# EAGLE design dual_uart (EAGLE 6.4)
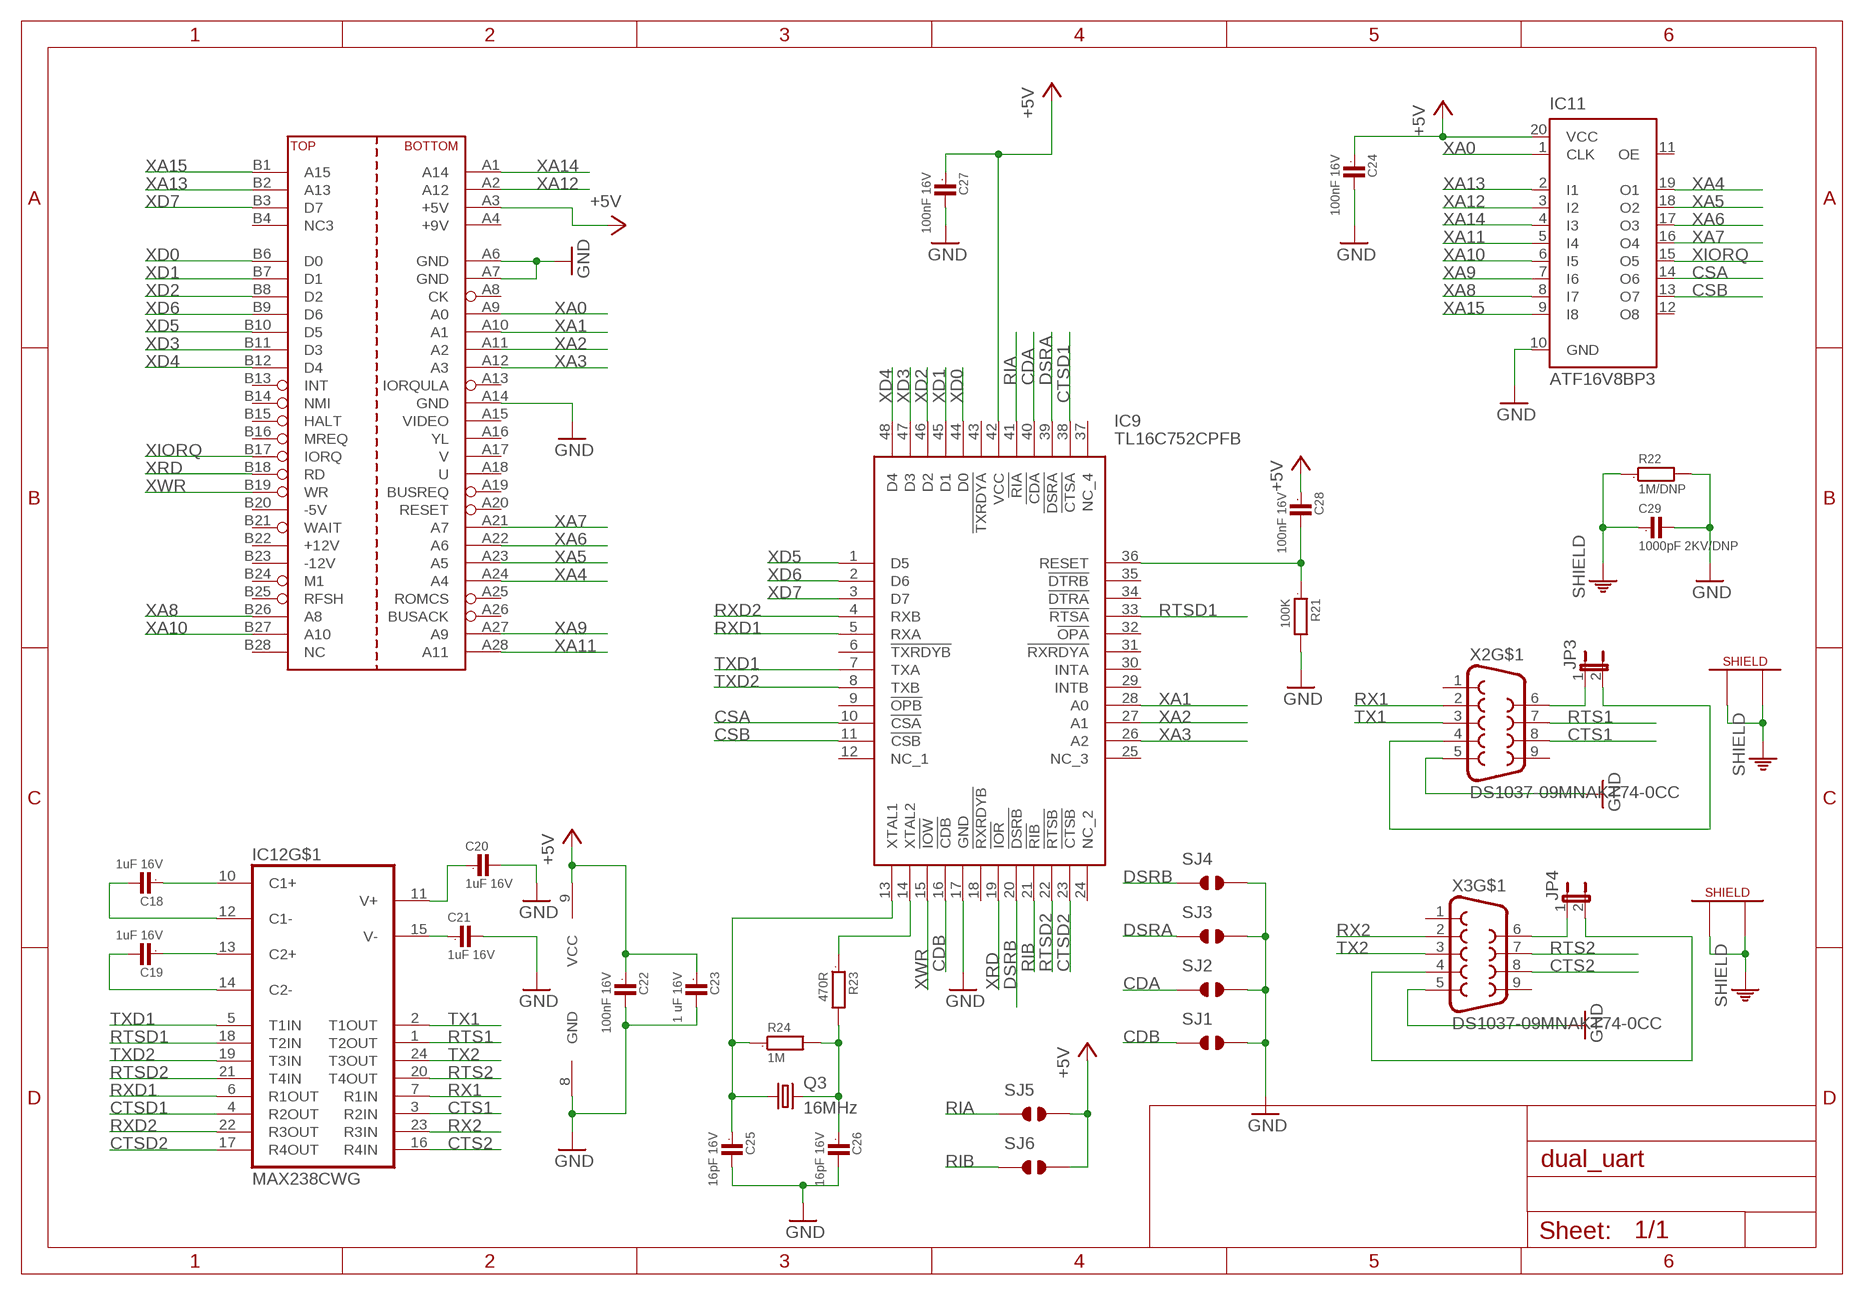
[diagram p0: schematic, sheet 1]

## Parts
C18  1uF 16V  C0603  [0603]
C19  1uF 16V  C0603  [0603]
C20  1uF 16V  C0603  [0603]
C21  1uF 16V  C0603  [0603]
C22  100nF 16V  C0603  [0603]
C23  1 uF 16V  C0603  [0603]
C24  100nF 16V  C0603  [0603]
C25  16pF 16V  C0603  [0603]
C26  16pF 16V  C0603  [0603]
C27  100nF 16V  C0603  [0603]
C28  100nF 16V  C0603  [0603]
C29  1000pF 2KV/DNP  C1210  [1210]
CONN2  ZX_EDGE_DAUGHTERBOARD  [ZX-EDGE-DAUGHTERBOARD@1]
IC9  TL16C752CPFB  [QFP50P900X900X120-48N]
IC11  ATF16V8BP3  [DIL20]
IC12  MAX238CWG  [SO24L]
JP3  JP1E  [JP1]
JP4  JP1E  [JP1]
Q3  16MHz  CRYSTALHC49S  [HC49/S]
R21  100K  R0603  [0603]
R22  1M/DNP  R0805  [0805]
R23  470R  R0603  [0603]
R24  1M  R0603  [0603]
SJ1  JUMPER_SOLDER_1X2  [JUMPER_SOLDER_1X2]
SJ2  JUMPER_SOLDER_1X2  [JUMPER_SOLDER_1X2]
SJ3  JUMPER_SOLDER_1X2  [JUMPER_SOLDER_1X2]
SJ4  JUMPER_SOLDER_1X2  [JUMPER_SOLDER_1X2]
SJ5  JUMPER_SOLDER_1X2  [JUMPER_SOLDER_1X2]
SJ6  JUMPER_SOLDER_1X2  [JUMPER_SOLDER_1X2]
X2  DS1037-09MNAKT74-0CC  DB9MALE  [DB9_MALE]
X3  DS1037-09MNAKT74-0CC  DB9MALE  [DB9_MALE]

## Nets
+5V: C22.1 C23.1 C24.1 C27.1 C28.1 CONN2.A3(+5V) IC9.42(VCC) IC11.20(VCC) IC12.9(VCC) SJ5.2 SJ6.2
CDA: IC9.40(!CDA) SJ2.1
CDB: IC9.16(!CDB) SJ1.1
CSA: IC9.10(!CSA) IC11.14(O6)
CSB: IC9.11(!CSB) IC11.13(O7)
CTS1: IC12.3(R2IN) X2.8
CTS2: IC12.16(R4IN) X3.8
CTSD1: IC9.38(!CTSA) IC12.4(R2OUT)
CTSD2: IC9.23(!CTSB) IC12.17(R4OUT)
DSRA: IC9.39(!DSRA) SJ3.1
DSRB: IC9.20(!DSRB) SJ4.1
GND: C20.2 C21.2 C22.2 C23.2 C24.2 C25.2 C26.2 C27.2 C29.2 CONN2.A6(GND) CONN2.A7(GND) CONN2.A14(GND) IC9.17(GND) IC11.10(GND) IC12.8(GND) R21.2 R22.2 SJ1.2 SJ2.2 SJ3.2 SJ4.2 X2.5 X3.5
N$20: C21.1 IC12.15(V-)
N$21: C20.1 IC12.11(V+)
N$22: C18.2 IC12.12(C1-)
N$23: C18.1 IC12.10(C1+)
N$24: C19.1 IC12.13(C2+)
N$25: C19.2 IC12.14(C2-)
N$26: JP4.1 X3.6
N$27: JP4.2 X3.4
N$28: JP3.1 X2.6
N$29: JP3.2 X2.4
N$30: C26.1 Q3.2 R23.2 R24.2
N$32: C25.1 IC9.13(XTAL1) Q3.1 R24.1
N$33: IC9.14(XTAL2) R23.1
N$46: C28.2 IC9.36(RESET) R21.1
PE: C29.1 R22.1 X2.G1 X2.G2 X3.G1 X3.G2 ; supply symbol labelled SHIELD
RIA: IC9.41(!RIA) SJ5.1
RIB: IC9.21(!RIB) SJ6.1
RTS1: IC12.1(T2OUT) X2.7
RTS2: IC12.20(T4OUT) X3.7
RTSD1: IC9.33(!RTSA) IC12.18(T2IN)
RTSD2: IC9.22(!RTSB) IC12.21(T4IN)
RX1: IC12.7(R1IN) X2.2
RX2: IC12.23(R3IN) X3.2
RXD1: IC9.5(RXA) IC12.6(R1OUT)
RXD2: IC9.4(RXB) IC12.22(R3OUT)
TX1: IC12.2(T1OUT) X2.3
TX2: IC12.24(T3OUT) X3.3
TXD1: IC9.7(TXA) IC12.5(T1IN)
TXD2: IC9.8(TXB) IC12.19(T3IN)
XA0: CONN2.A9(A0) IC11.1(CLK)
XA1: CONN2.A10(A1) IC9.28(A0)
XA2: CONN2.A11(A2) IC9.27(A1)
XA3: CONN2.A12(A3) IC9.26(A2)
XA4: CONN2.A24(A4) IC11.19(O1)
XA5: CONN2.A23(A5) IC11.18(O2)
XA6: CONN2.A22(A6) IC11.17(O3)
XA7: CONN2.A21(A7) IC11.16(O4)
XA8: CONN2.B26(A8) IC11.8(I7)
XA9: CONN2.A27(A9) IC11.7(I6)
XA10: CONN2.B27(A10) IC11.6(I5)
XA11: CONN2.A28(A11) IC11.5(I4)
XA12: CONN2.A2(A12) IC11.3(I2)
XA13: CONN2.B2(A13) IC11.2(I1)
XA14: CONN2.A1(A14) IC11.4(I3)
XA15: CONN2.B1(A15) IC11.9(I8)
XD0: CONN2.B6(D0) IC9.44(D0)
XD1: CONN2.B7(D1) IC9.45(D1)
XD2: CONN2.B8(D2) IC9.46(D2)
XD3: CONN2.B11(D3) IC9.47(D3)
XD4: CONN2.B12(D4) IC9.48(D4)
XD5: CONN2.B10(D5) IC9.1(D5)
XD6: CONN2.B9(D6) IC9.2(D6)
XD7: CONN2.B3(D7) IC9.3(D7)
XIORQ: CONN2.B17(IORQ) IC11.15(O5)
XRD: CONN2.B18(RD) IC9.19(!IOR)
XWR: CONN2.B19(WR) IC9.15(!IOW)
Unconnected: CONN2.A8(CK) CONN2.A13(IORQULA) CONN2.A15(VIDEO) CONN2.A16(YL) CONN2.A17(V) CONN2.A18(U) CONN2.A19(BUSREQ) CONN2.A20(RESET) CONN2.A25(ROMCS) CONN2.A26(BUSACK) CONN2.B4(NC3) CONN2.B13(INT) CONN2.B14(NMI) CONN2.B15(HALT) CONN2.B16(MREQ) CONN2.B21(WAIT) CONN2.B24(M1) CONN2.B25(RFSH) CONN2.B28(NC) IC9.6(!TXRDYB) IC9.9(!OPB) IC9.12(NC_1) IC9.18(!RXRDYB) IC9.24(NC_2) IC9.25(NC_3) IC9.29(INTB) IC9.30(INTA) IC9.31(!RXRDYA) IC9.32(!OPA) IC9.34(!DTRA) IC9.35(!DTRB) IC9.37(NC_4) IC9.43(!TXRDYA) IC11.11(OE) IC11.12(O8) X2.1 X2.9 X3.1 X3.9

## Power pins joined to a net without a drawn wire
+9V: CONN2.A4(+9V)
+12V: CONN2.B22(+12V)
-5V: CONN2.B20(-5V)
-12V: CONN2.B23(-12V)

## Library data of the parts
C18-C29 = GadgetFactory:C: CAPACITOR, European symbol
CONN2 = zxspectrum:ZX_EDGE_DAUGHTERBOARD
IC9 = SamacSys_Parts:TL16C752CPFB: Dual UART With 64-Byte FIFO Source: Datasheet <http://www.ti.com/lit/gpn/tl16c752c>; DESCRIPTION: Dual UART With 64-Byte FIFO; HEIGHT: 1.2mm; MANUFACTURER_NAME: Texas Instruments; MANUFACTURER_PART_NUMBER: TL16C752CPFB; MOUSER_PART_NUMBER: 595-TL16C752CPFB; MOUSER_PRICE-STOCK: https://www.mouser.com/Search/Refine.aspx?Keyword=595-TL16C752CPFB
IC11 = atmel:ATF16V8B: High perfomance CMOS (electrically erasable) programmable logic device (PLD) ABLE-Atmel-ABEL - P18V8R, P16V8C, P16V8AS, P17V8 COPL Atmel-WinCUPL - G16V8MS, G16V8MA, G16V8AS, G16V8 LOG/IC - GAL16V8_R, GAL16V8_G7, GAL16V8_C), GAL16V8 Tango-PLD - G16V8R, G16V8C, G16V8AS, G16V8 Source: http://www.atmel.com/dyn/resources/prod_documents/DOC0364.PDF; MPN: ATF16V8CZ-15PU; OC_FARNELL: 1551768; OC_NEWARK: 94M6254
IC12 = alvie:MAX238
JP3 JP4 = jumper:JP1E: JUMPER
Q3 = crystal:CRYSTAL: CRYSTAL; OC_FARNELL: 1667008; OC_NEWARK: unknown
R21-R24 = GadgetFactory:R: RESISTOR, European symbol
SJ1-SJ6 = dp_devices:JUMPER_SOLDER_1X2
X2 X3 = SparkFun-Connectors:DB9: DB9 Connector Standard DB9 (D-Sub 9) serial connector. Can be used for CAN bus as well as RS485 and RS232. Footprint production proven. Spark Fun Electronics SKU : PRT-00429

## Board
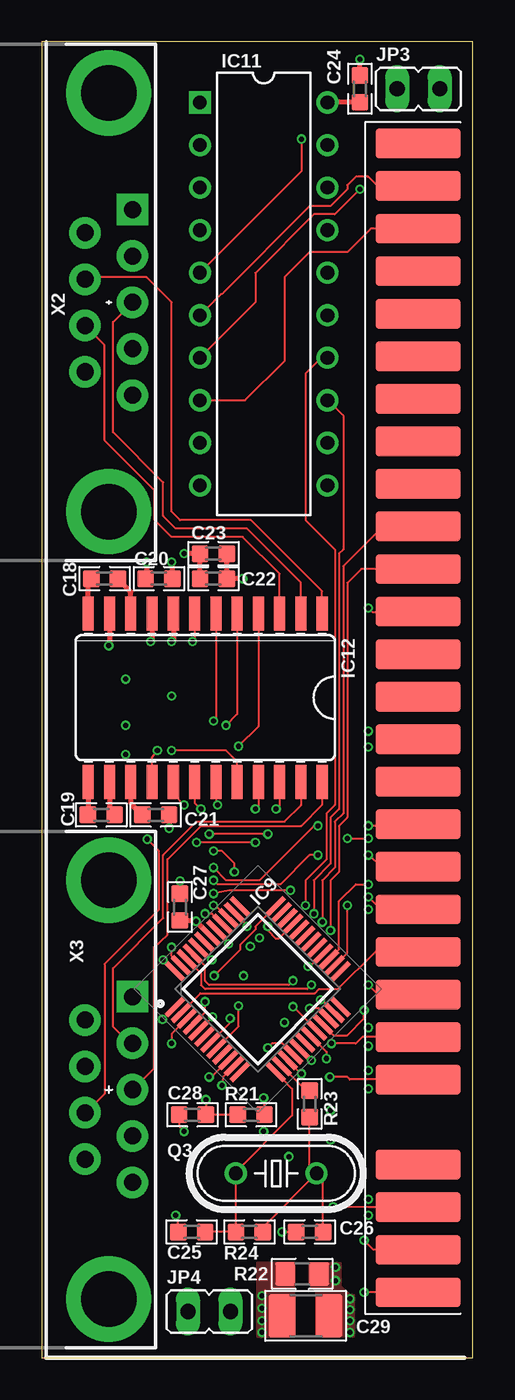
[diagram p1: board, top side]
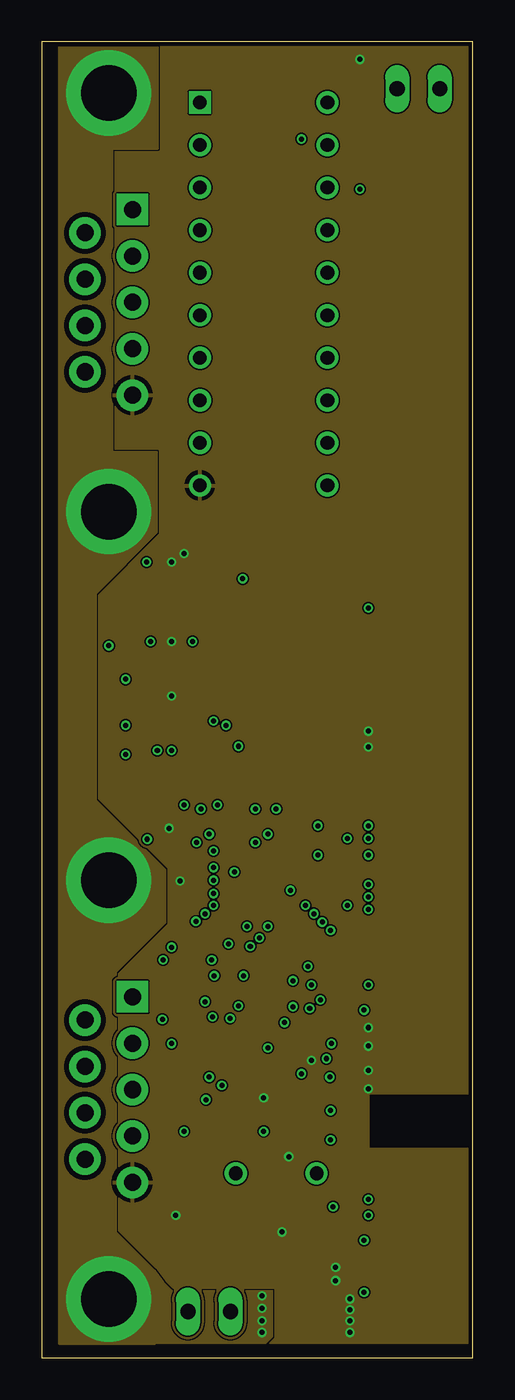
[diagram p2: board, inner layer Route2]
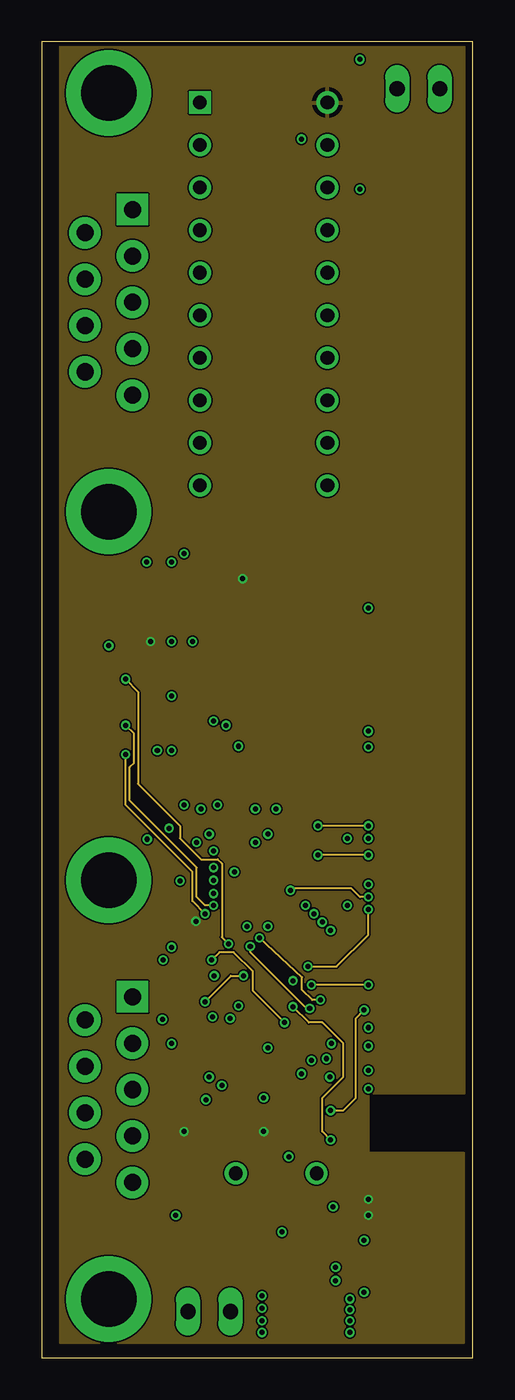
[diagram p3: board, inner layer Route15]
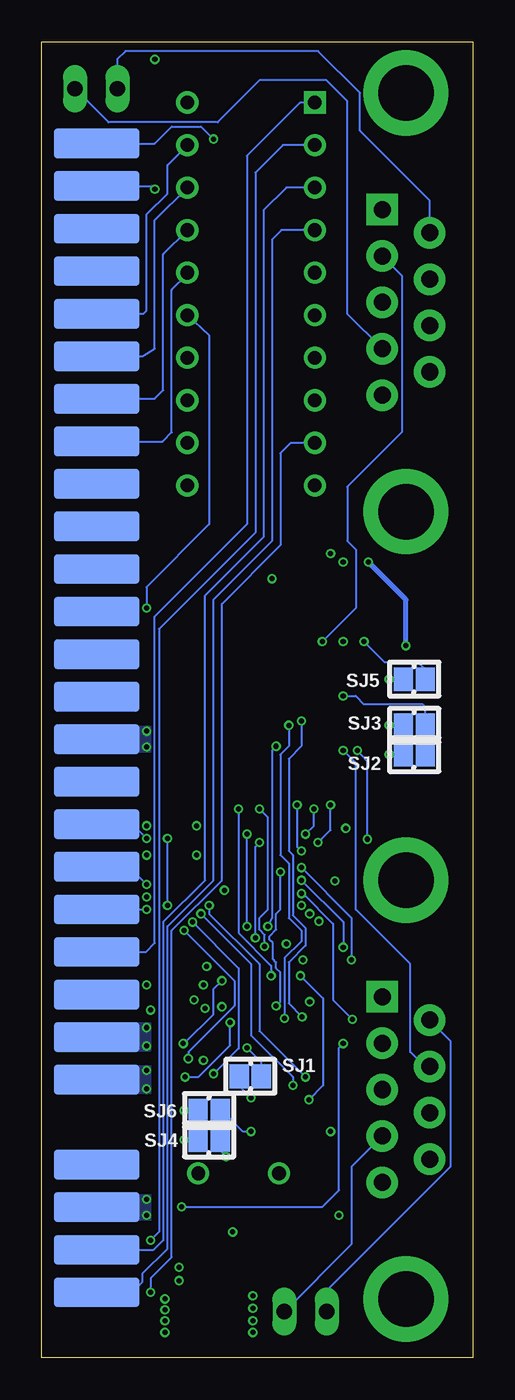
[diagram p4: board, bottom side, seen from below]

Size 25.75 x 78.55 mm. Coordinates in mm from the lower left corner, seen from the top.
Outline: 0,0 25.75,0 25.75,78.55 0,78.55 0,0
Copper layers (1*2*15*16): Top 0.035mm / dielectric 0.18mm / Route2 0.017mm / dielectric 1.12mm / Route15 0.017mm / dielectric 0.18mm / Bottom 0.035mm
Design rules "JLCPCB-FourLayerLayer": minimum track width 3.5mil, minimum drill 0.2mm, track to track 3.5mil, track to pad 5mil, pad to pad 5mil, via to via 5mil, smd to smd 0mil, copper to edge 10mil, drill to drill 10mil, minimum pad ring 10mil, minimum via ring 0.125mm, stop-mask expansion 2mil, vias tented up to drill 100mil, thermal gap 10mil

### Footprints (pad centres in the part's own frame; a part is rotated, then mirrored left to right if it is on the bottom)
0603 = smd 1 x 1: 1 -0.8,0; 2 0.8,0
1210 = smd 1.6 x 2.6: 1 -1.4,0; 2 1.4,0
ZX-EDGE-DAUGHTERBOARD@1 = smd 1.778 x 5.08 bottom: A1 6.35,-1.27; A2 3.81,-1.27; A3 1.27,-1.27; A4 -1.27,-1.27; A6 -6.35,-1.27; A7 -8.89,-1.27; A8 -11.43,-1.27; A9 -13.97,-1.27; A10 -16.51,-1.27; A11 -19.05,-1.27; A12 -21.59,-1.27; A13 -24.13,-1.27; A14 -26.67,-1.27; A15 -29.21,-1.27; A16 -31.75,-1.27; A17 -34.29,-1.27; A18 -36.83,-1.27; A19 -39.37,-1.27; A20 -41.91,-1.27; A21 -44.45,-1.27; A22 -46.99,-1.27; A23 -49.53,-1.27; A24 -52.07,-1.27; A25 -54.61,-1.27; A26 -57.15,-1.27; A27 -59.69,-1.27; A28 -62.23,-1.27 | smd 1.778 x 5.08: B1 6.35,-1.27; B2 3.81,-1.27; B3 1.27,-1.27; B4 -1.27,-1.27; B6 -6.35,-1.27; B7 -8.89,-1.27; B8 -11.43,-1.27; B9 -13.97,-1.27; B10 -16.51,-1.27; B11 -19.05,-1.27; B12 -21.59,-1.27; B13 -24.13,-1.27; B14 -26.67,-1.27; B15 -29.21,-1.27; B16 -31.75,-1.27; B17 -34.29,-1.27; B18 -36.83,-1.27; B19 -39.37,-1.27; B20 -41.91,-1.27; B21 -44.45,-1.27; B22 -46.99,-1.27; B23 -49.53,-1.27; B24 -52.07,-1.27; B25 -54.61,-1.27; B26 -57.15,-1.27; B27 -59.69,-1.27; B28 -62.23,-1.27
QFP50P900X900X120-48N = smd 1.475 x 0.3: 1 -4.238,2.75; 2 -4.238,2.25; 3 -4.238,1.75; 4 -4.238,1.25; 5 -4.238,0.75; 6 -4.238,0.25; 7 -4.238,-0.25; 8 -4.238,-0.75; 9 -4.238,-1.25; 10 -4.238,-1.75; 11 -4.238,-2.25; 12 -4.238,-2.75; 25 4.238,-2.75; 26 4.238,-2.25; 27 4.238,-1.75; 28 4.238,-1.25; 29 4.238,-0.75; 30 4.238,-0.25; 31 4.238,0.25; 32 4.238,0.75; 33 4.238,1.25; 34 4.238,1.75; 35 4.238,2.25; 36 4.238,2.75 | smd 0.3 x 1.475: 13 -2.75,-4.238; 14 -2.25,-4.238; 15 -1.75,-4.238; 16 -1.25,-4.238; 17 -0.75,-4.238; 18 -0.25,-4.238; 19 0.25,-4.238; 20 0.75,-4.238; 21 1.25,-4.238; 22 1.75,-4.238; 23 2.25,-4.238; 24 2.75,-4.238; 37 2.75,4.238; 38 2.25,4.238; 39 1.75,4.238; 40 1.25,4.238; 41 0.75,4.238; 42 0.25,4.238; 43 -0.25,4.238; 44 -0.75,4.238; 45 -1.25,4.238; 46 -1.75,4.238; 47 -2.25,4.238; 48 -2.75,4.238
DIL20 = drill 0.813 square: 1 -11.43,-3.81 | drill 0.813: 2 -8.89,-3.81; 3 -6.35,-3.81; 4 -3.81,-3.81; 5 -1.27,-3.81; 6 1.27,-3.81; 7 3.81,-3.81; 8 6.35,-3.81; 9 8.89,-3.81; 10 11.43,-3.81; 11 11.43,3.81; 12 8.89,3.81; 13 6.35,3.81; 14 3.81,3.81; 15 1.27,3.81; 16 -1.27,3.81; 17 -3.81,3.81; 18 -6.35,3.81; 19 -8.89,3.81; 20 -11.43,3.81
SO24L = smd 0.66 x 2.032: 1 -6.495,-5.679; 2 -5.225,-5.679; 3 -3.955,-5.679; 4 -2.685,-5.679; 5 -1.415,-5.679; 6 -0.145,-5.679; 7 1.125,-5.679; 8 2.395,-5.679; 9 3.665,-5.679; 10 4.935,-5.679; 11 6.205,-5.679; 12 7.475,-5.679; 13 7.475,4.379; 14 6.205,4.379; 15 4.935,4.379; 16 3.665,4.379; 17 2.395,4.379; 18 1.125,4.379; 19 -0.145,4.379; 20 -1.415,4.379; 21 -2.685,4.379; 22 -3.955,4.379; 23 -5.225,4.379; 24 -6.495,4.379
JP1 = drill 0.914 long: 1 0,-1.27; 2 0,1.27
HC49/S = drill 0.813: 1 -2.413,0; 2 2.413,0
0805 = smd 1.2 x 1.4: 1 -1,0; 2 1,0
JUMPER_SOLDER_1X2 = smd 1.143 x 1.422: 1 -0.66,0; 2 0.66,0
DB9_MALE = drill 1.016 pad 1.88 square: 1 5.54,-1.42 | drill 1.016 pad 1.88: 2 2.77,-1.42; 3 0,-1.42; 4 -2.77,-1.42; 5 -5.54,-1.42; 6 4.15,1.42; 7 1.38,1.42; 8 -1.38,1.42; 9 -4.15,1.42 | drill 3.302 pad 5.08: G1 -12.5,0; G2 12.5,0

### Placement (x,y rotation side)
C18  3.75,46.5 180 top
C19  3.55,32.4 0 top
C20  7,46.5 0 top
C21  6.8,32.4 0 top
C22  10.25,46.5 180 top
C23  10.25,48 180 top
C24  19,75.75 90 top
C25  8.95,7.5 180 top
C26  16,7.5 180 top
C27  8.25,26.9 90 top
C28  9,14.5 0 top
C29  15.75,2.5 0 top
CONN2  23.75,10.25 270 top
IC9  12.9,22 45 top
IC11  13.25,63.5 270 top
IC12  10.25,38.75 180 top
JP3  22.5,75.75 270 top
JP4  10,2.75 270 top
Q3  14,11 0 top
R21  12.5,14.5 0 top
R22  15.55,5 0 top
R23  16,15.15 270 top
R24  12.4,7.5 0 top
SJ1  13.3,16.8 180 bottom
SJ2  3.5,36 0 bottom
SJ3  3.5,37.75 0 bottom
SJ4  15.75,13 0 bottom
SJ5  3.5,40.5 0 bottom
SJ6  15.75,14.75 0 bottom
X2  4,63 90 top
X3  4,16 90 top

### Tracks (layer width: path | path; a pad name or v marks a point on that pad's centre or on a via)
+5V  (via drill 0.3)
  Top 0.128: C28.1 8.2,13.8 v8.5,13.5
  Top 0.305: IC12.9 6.58,42.84 v6.5,42.75 | v12,46.5 C22.1 C23.1 | C24.1 17.08,74.95 IC11.20 | IC9.42 v9.2,26.05 9.25,26.1 C27.1
  Bottom 0.128: SJ5.2 2.84,41.09 3.25,41.5 5.25,41.5 v6.5,42.75 | SJ6.2 15,14.75 13.75,13.5 v13.25,13.5
  other vias: 19.5,9.45 19.5,8.5
  pour Route15: 1.1,78.5 25.25,78.5 25.25,15.75 19.5,15.75 19.5,12.25 25.2,12.25 25.2,0.85 1.1,0.85
  pour Bottom (no thermals): 19.25,9.7 20.3,9.7 20.3,8.25 19.25,8.25
CDA  (via drill 0.3)
  Top 0.128: IC9.40 10.17,26.5 v9.75,26.5
  Route15 0.128: v9.75,26.5 9,27.25 9,29 5,33 v5,36
  Bottom 0.128: v5,36 SJ2.1
CDB  (via drill 0.3)
  Top 0.128: IC9.16 14.38,18.75 13.75,18.75 v13.5,18.5
  Bottom 0.128: SJ1.1 12.64,17.64 v13.5,18.5
CSA  (via drill 0.3)
  Top 0.128: IC11.14 16.69,59.69 15.75,58.75 15.75,50 17.5,48.25 17.5,33 17,32.5 17,29.75 15.75,28.5 v15.75,27 | IC9.10 10.12,16.75 v10,16.75
  Bottom 0.128: v15.75,27 15.75,26.5 12.75,23.5 12.75,19.5 v10,16.75
CSB  (via drill 0.3)
  Top 0.128: IC11.13 17.1,57.15 18,56.25 18,48.25 17.75,48 17.75,32.75 17.25,32.25 17.25,29.5 16.25,28.5 v16.25,26.5 | IC9.11 10.83,16.75 v10.75,16.25
  Bottom 0.128: v16.25,26.5 13.25,23.5 13.25,19.25 10.75,16.75 v10.75,16.25
CTS1
  Top 0.128: IC12.3 14.21,46.8 12,49 7.75,49 6.75,50 6.75,51.75 3.75,54.75 3.75,60.45 X2.8
CTS2  (via drill 0.3)
  Top 0.128: v6.3,30.95 7,30.25 7,26.75 3.75,23.5 3.75,15.75 2.62,14.62 X3.8 | IC12.16 6.58,35.81 v6.9,36.25
  Bottom 0.128: v6.3,30.95 6.3,35.6 v6.9,36.25
CTSD1  (via drill 0.3)
  Top 0.128: IC12.4 12.94,37.69 v11.75,36.5 | IC9.38 12.25,25.83 v12.25,25.75
  Bottom 0.128: v11.75,36.5 12,36.25 12,26.25 v12.25,25.75
CTSD2  (via drill 0.3)
  Top 0.128: IC9.23 16.73,21.35 v16.65,21.35 | v12.75,30.75 v9.25,30.75 | IC12.17 7.86,33.65 v8.5,33
  Route15 0.128: v16.65,21.35 16.15,21.35 15.55,21.95 15.55,22.7 v13,25.05
  Bottom 0.128: v13,25.05 13,30.5 v12.75,30.75 | v9.25,30.75 8.5,31.5 v8.5,33
DSRA  (via drill 0.3)
  Top 0.128: IC9.39 10.38,27 v10.25,27
  Route15 0.128: v10.25,27 9.75,27 9.25,27.5 9.25,29.25 5.25,33.25 5.25,35.25 5.5,35.5 5.5,37.25 v5,37.75
  Bottom 0.128: v5,37.75 SJ3.1
DSRB  (via drill 0.3)
  Top 0.128: IC9.20 15.21,20.75 v15,20.95
  Route15 0.128: v17.25,13 16.75,13.5 16.75,15.5 18,16.75 18,18.75 16.75,20 15.95,20 v15,20.95
  Bottom 0.128: SJ4.1 v17.25,13
GND  (via drill 0.3)
  Top 0.128: v14.35,7.5 C26.2 | R21.2 13.3,15.45 v13.25,15.5 | C25.2 8.15,8.35 v8,8.5
  Top 0.305: C21.2 v7.6,31.6 | C20.2 7.8,47.45 v7.75,47.5 | C22.2 C23.2 v8.5,48 | C24.2 v19,77.5 | C27.2 v8.25,28.45 | IC9.17 16.09,17.75 v16.1,17.75 | IC12.8 7.86,42.85 v7.75,42.75
  Bottom 0.128: SJ1.2 13.96,16.21 v13.25,15.5 | SJ2.2 SJ3.2 2.84,38.84 3,39 6.5,39 7,39.5 v7.75,39.5 | SJ4.2 15.09,12.34 v14.75,12
  other vias: 19.5,37.4 19.5,36.45 19.5,19.7 19.5,18.6 19.5,17.15 19.5,16.05 17.55,5.4 17.55,4.6 18.4,3.5 18.4,2.85 18.4,2.2 18.4,1.5
  pour Route2 (rank 3): 1.1,78.5 25.5,78.5 25.5,15.75 19.5,15.75 19.5,12.5 25.5,12.5 25.5,0.85 1.1,0.85
  pour Bottom (no thermals): 19.25,37.65 20.3,37.65 20.3,36.2 19.25,36.2
  pour Bottom (no thermals): 19.25,19.95 20.3,19.95 20.3,18.35 19.25,18.35
  pour Bottom (no thermals): 19.25,17.4 20.3,17.4 20.3,15.8 19.25,15.8
  pour Top (no thermals): 16,5.65 17.85,5.65 17.85,4.3 18.4,3.75 18.65,3.75 18.65,1.25 16.4,1.25 16.4,3.95 16,4.35
N$20
  Top 0.305: IC12.15 5.32,33.09 C21.1
N$21  (via drill 0.3)
  Top 0.305: IC12.11 4.04,42.55 v4,42.5 | v6.25,47.5 6.25,46.55 C20.1
  Bottom 0.305: v4,42.5 4,45.25 v6.25,47.5
N$22
  Top 0.305: IC12.12 2.77,46.33 C18.2
N$23
  Top 0.305: IC12.10 5.32,45.73 C18.1
N$24
  Top 0.128: 2.77,32.42 C19.1
  Top 0.305: IC12.13 2.77,32.42
N$25
  Top 0.128: 4.04,32.7 C19.2
  Top 0.305: IC12.14 4.04,32.7
N$26
  Bottom 0.128: JP4.1 8.75,2.77 8.75,4 1.35,11.4 1.35,18.92 X3.6
N$27
  Bottom 0.128: JP4.2 7.25,6.77 7.25,11.4 X3.4
N$28
  Bottom 0.128: JP3.1 21.25,75.77 21.25,77.5 20.75,78 9.25,78 6.75,75.5 6.75,73.25 2.58,69.08 X2.6
N$29
  Bottom 0.128: JP3.2 21.77,73.75 15.25,73.75 12.75,76.25 8.75,76.25 7.5,75 7.5,62.31 X2.4
N$30
  Top 0.128: C26.1 16.8,10.61 Q3.2 | Q3.2 16,11.41 R23.2 | R24.2 13.2,7.79 Q3.2
N$32
  Top 0.128: IC9.13 14.3,16.7 14.95,16.05 14.95,14.45 11.59,11.09 Q3.1 11.6,10.99 R24.1 C25.1
N$33
  Top 0.128: 14.66,17.04 IC9.14 15.77,15.95 R23.1
N$46  (via drill 0.3)
  Top 0.128: IC9.36 12.75,25.74 12.75,25.55 11.85,24.65 11.85,24.35 v10.3,22.8 | v9.8,15.4 C28.2 R21.1
  Bottom 0.128: v10.3,22.8 8.95,21.45 8.95,16.25 v9.8,15.4
PE  (via drill 0.3)
  other vias: 13.15,3.7 13.15,2.95 13.15,2.2 13.15,1.5
  pour Route2 (isolate 0.305, no thermals): 1.05,78.25 6.9,78.25 6.9,72.15 4.2,72.15 4.2,54.1 6.85,54.1 6.85,49.25 3.2,45.6 3.2,33.3 7.35,29.15 7.35,25.95 4.4,23 4.4,7.5 6.7,5.2 7.25,4.5 7.75,4 13.75,4 13.75,1.25 13.35,0.85 6.7,0.85 6.75,0.8 1.05,0.8
  pour Top (no thermals): 15.1,5.65 12.85,5.65 12.85,1.25 15.1,1.25
RIA  (via drill 0.3)
  Top 0.128: IC9.41 11.15,24.81 v11.15,24.7
  Route15 0.128: v5,40.5 5.75,39.75 5.75,34.25 8.25,31.75 8.25,31 9.5,29.75 10.5,29.75 10.75,29.5 10.75,25.1 v11.15,24.7
  Bottom 0.128: SJ5.1 v5,40.5
RIB  (via drill 0.3)
  Top 0.128: IC9.21 17.42,19.25 18.25,19.25 19.25,20.25 v19.25,20.75
  Route15 0.128: v17.25,14.75 18,14.75 18.75,15.5 18.75,20.25 v19.25,20.75
  Bottom 0.128: SJ6.1 v17.25,14.75
RTS1
  Top 0.128: IC12.1 16.75,45.76 12.5,50 8.25,50 7.75,50.5 7.75,63 6.25,64.5 2.7,64.5 X2.7
RTS2  (via drill 0.3)
  Top 0.128: IC12.20 11.66,35.59 11,36.25 v7.75,36.25
  Bottom 0.128: v7.75,36.25 7,35.5 7,26.75 3.75,23.5 3.75,18.25 2.88,17.38 X3.7
RTSD1  (via drill 0.3)
  Top 0.128: IC9.33 14.13,25 14,25 13.5,25.5 v13.5,25.75 | v13.5,31.25 v10,31.25 | v9.5,32.75 9.12,33.12 IC12.18
  Bottom 0.128: v13.5,25.75 v13.5,31.25 | v10,31.25 9.5,31.75 v9.5,32.75
RTSD2  (via drill 0.3)
  Top 0.128: IC9.22 16.52,20.85 v16,20.85 | 12.8,32.8 v12.75,32.75 12.94,32.94 IC12.21
  Route15 0.128: v16,20.85 15.8,20.85 12.45,24.2 v12.45,24.55
  Bottom 0.128: v12.45,24.55 12.45,25.25 12.75,25.55 12.75,26.25 12.25,26.75 12.25,32.25 v12.75,32.75
RX1  (via drill 0.3)
  Top 0.128: 9.1,42.85 v9,42.75 9.12,42.88 IC12.7
  Bottom 0.128: v9,42.75 7,44.75 7,48.25 7.5,48.75 7.5,52 4.25,55.25 4.25,64.6 X2.2
RX2
  Top 0.128: IC12.23 15.47,32.98 14.5,32 9.25,32 7.25,30 7.25,26.25 4.25,23.25 4.25,19.75 5.23,18.77 X3.2
RXD1  (via drill 0.3)
  Top 0.128: IC12.6 10.39,38.15 v10.25,38 | IC9.5 v10.19,20.35 v10.2,20.35
  Bottom 0.128: v10.25,38 10.25,36.5 11,35.75 11,30.25 10.75,30 10.75,26.4 10,25.65 10,24.6 11,23.6 11,21.15 v10.2,20.35
RXD2  (via drill 0.3)
  Top 0.128: IC12.22 14.21,32.95 v14,32.75 | IC9.4 9.75,20.62 v9.75,21.25
  Route15 0.128: v9.75,21.25 11.3,22.8 v12.05,22.8
  Bottom 0.128: v14,32.75 14,25.35 12.05,23.4 v12.05,22.8
TX1
  Top 0.128: IC12.2 15.47,46.27 12.25,49.5 8,49.5 7.25,50.25 7.25,52.25 4.25,55.25 4.25,61.83 X2.3
TX2
  Top 0.128: IC12.24 16.75,32.99 15.5,31.75 9.5,31.75 7.5,29.75 7.5,25.25 6.7,24.5 6.7,17.28 X3.3
TXD1  (via drill 0.3)
  Top 0.128: IC12.5 11.66,38.41 v11,37.75 | IC9.7 11.25,20 v11.25,20.25
  Bottom 0.128: v11,37.75 11,36.5 11.5,36 11.5,30 11,29.5 11,26.25 10.25,25.5 10.25,24.85 11.25,23.85 v11.25,20.25
TXD2  (via drill 0.3)
  Top 0.128: IC12.19 10.39,33.1 v10.5,33 | IC9.8 11.75,19.79 v11.75,21 | v11.5,29 11.5,29.5 10.75,30.25 v10.25,30.25
  Bottom 0.128: v10.5,33 10.5,30.5 v10.25,30.25 | v11.75,21 11.5,21.25 11.5,23 11.75,23.25 11.75,23.6 11.95,23.8 11.95,24.75 12.15,24.95 12.15,25.15 11.75,25.55 11.75,26.5 11.5,26.75 v11.5,29
XA0
  Bottom 0.128: CONN2.A9 19.53,24.22 19,24.75 19,44.25 13.5,49.75 13.5,71.75 10.32,74.93 IC11.1
XA1  (via drill 0.3)
  Top 0.128: IC9.28 16.02,23.35 v15.9,23.35
  Route15 0.128: v15.9,23.35 17.6,23.35 19.5,25.25 v19.5,26.75
  Bottom 0.128: CONN2.A10 v19.51,26.76 v19.5,26.75
XA2  (via drill 0.3)
  Top 0.128: IC9.27 17.75,24.38 17.75,27.25 18.75,28.25 v19.5,28.25
  Bottom 0.128: CONN2.A11 20.55,29.3 v19.5,28.25
XA3  (via drill 0.3)
  Top 0.128: IC9.26 18.25,24.17 v18.25,27 | v18.25,31 v19.5,31
  Bottom 0.128: CONN2.A12 20.34,31.84 v19.5,31 | v18.25,27 v18.25,31
XA4
  Bottom 0.128: CONN2.A24 19.68,62.32 19.5,62.5 19.5,68.25 18.25,69.5 18.25,71.2 IC11.19
XA5
  Bottom 0.128: CONN2.A23 19.72,59.78 19,60.25 19,67.91 IC11.18
XA6
  Bottom 0.128: CONN2.A22 19.01,57.24 18.5,57.75 18.5,65.87 IC11.17
XA7
  Bottom 0.128: CONN2.A21 18.55,54.7 18,55.25 18,63.75 17.06,64.69 IC11.16
XA8
  Top 0.128: CONN2.B26 19.65,67.4 18.25,66 16,66 14.5,64.5 14.5,59.5 12.15,57.15 IC11.8
XA9  (via drill 0.3)
  Top 0.128: v19,69.75 17.5,68.25 16.25,68.25 12.75,64.75 12.75,63 IC11.7
  Bottom 0.128: CONN2.A27 19.19,69.94 v19,69.75
XA10
  Top 0.128: CONN2.B27 20.06,69.94 19.5,70.5 18.75,70.5 18.25,70 18.25,69.75 17.25,68.75 16,68.75 10.75,63.5 10.71,63.5 IC11.6
XA11  (via drill 0.3)
  Top 0.128: v15.5,72.75 15.5,70.83 IC11.5
  Bottom 0.128: CONN2.A28 19.02,72.48 18,73.5 16.25,73.5 v15.5,72.75
XA12
  Bottom 0.128: CONN2.A2 19.06,6.44 18.5,7 18.5,26 16,28.5 16,45.5 12.5,49 12.5,68.5 11.15,69.85 IC11.3
XA13  (via drill 0.3)
  Top 0.128: CONN2.B2 19.81,6.44 v19.25,7
  Bottom 0.128: IC11.2 11.36,72.39 13,70.75 13,49.25 18.75,43.5 18.75,7.5 v19.25,7
XA14
  Bottom 0.128: CONN2.A1 20.35,3.9 19.75,4.5 19.75,5 18.25,6.5 18.25,25.75 15.5,28.5 15.5,45.25 12,48.75 12,66.75 11.44,67.31 IC11.4
XA15  (via drill 0.3)
  Top 0.128: CONN2.B1 v19.25,3.9
  Bottom 0.128: IC11.9 10.89,54.61 11.5,54 11.5,48.5 15,45 15,28.5 18,25.5 18,6 19.25,4.75 v19.25,3.9
XD0  (via drill 0.3)
  Top 0.128: CONN2.B6 18.4,16.6 18.25,16.75 v17.2,16.75 | v10.15,23.75 10.1,23.74 IC9.44
  Route15 0.128: v10.15,23.75 10.6,24.2 11.45,24.2 12.6,23.05 12.6,21.9 v14.5,20
  Bottom 0.128: v17.2,16.75 16.4,16.75 14.5,18.65 v14.5,20
XD1  (via drill 0.3)
  Top 0.128: CONN2.B7 19.14,19.14 18.75,18.75 v17.3,18.75 | v15,22.5 14.75,22.25 10,22.25 9.75,22.5 9.75,23.38 IC9.45
  Bottom 0.128: v17.3,18.75 17.25,18.75 15.5,20.5 15.5,22 v15,22.5
XD2  (via drill 0.3)
  Top 0.128: CONN2.B8 20.07,21.68 v19.5,22.25 | v16.1,22.25 15.85,22 9.75,22 9.5,22.25 9.5,22.93 IC9.46
  Route15 0.128: v19.5,22.25 v16.1,22.25
XD3  (via drill 0.3)
  Top 0.128: CONN2.B11 20.3,29.3 v19.5,30 | v16.5,30 16,30 14.25,28.25 10.5,28.25 v10.25,28.5 | IC9.47 7.75,23.97 v7.75,24.5
  Route15 0.128: v19.5,30 v16.5,30
  Bottom 0.128: v10.25,28.5 7.75,26 v7.75,24.5
XD4  (via drill 0.3)
  Top 0.128: CONN2.B12 22.39,31.75 v19.5,31.75 | v16.5,31.75 16.25,31.75 13,28.5 11,28.5 v10.25,29.25 | IC9.48 v7.26,23.75 v7.25,23.75
  Route15 0.128: v19.5,31.75 v16.5,31.75
  Bottom 0.128: v10.25,29.25 7.25,26.25 v7.25,23.75
XD5  (via drill 0.3)
  Top 0.128: CONN2.B10 20.24,26.76 v19.5,27.5 | v14.85,27.9 11.2,27.9 v10.25,27.7 | IC9.1 7.95,20.95 v7.2,20.2
  Route15 0.128: v19.5,27.5 19,27.5 18.5,28 14.95,28 v14.85,27.9
  Bottom 0.128: v10.25,27.7 10.15,27.7 8.35,25.9 8.35,21.35 v7.2,20.2
XD6
  Top 0.128: IC9.2 9.47,21.75 16.3,21.75 16.55,22 17.7,22 19.92,24.22 CONN2.B9
XD7  (via drill 0.3)
  Top 0.128: CONN2.B3 19.52,8.98 v17.4,9 | IC9.3 7.75,19.32 v7.75,18.75
  Bottom 0.128: v17.4,9 9,9 8,10 8,18.5 v7.75,18.75
XIORQ  (via drill 0.3)
  Top 0.128: v19.5,44.75 19.75,44.5 22.44,44.5 CONN2.B17
  Bottom 0.128: IC11.15 15.75,61.04 15.75,49.75 19.5,46 v19.5,44.75
XRD  (via drill 0.3)
  Top 0.128: CONN2.B18 19.08,47.08 18.25,46.25 18.25,32.25 17.75,31.75 17.75,29 17.25,28.5 v17.25,25.5 | IC9.19 17,18.25 v17,17.85
  Bottom 0.128: v17.25,25.5 14.25,22.5 14.25,21 17,18.25 v17,17.85
XWR  (via drill 0.3)
  Top 0.128: CONN2.B19 20.37,49.62 18,47.25 18,32.5 17.5,32 17.5,29.25 16.75,28.5 v16.75,26 | IC9.15 15.43,17 v15.5,16.95
  Bottom 0.128: v16.75,26 14,23.25 14,18.45 v15.5,16.95